# EAGLE schematic TamarinGroupMonitor1 v24 (EAGLE 9.7.0)
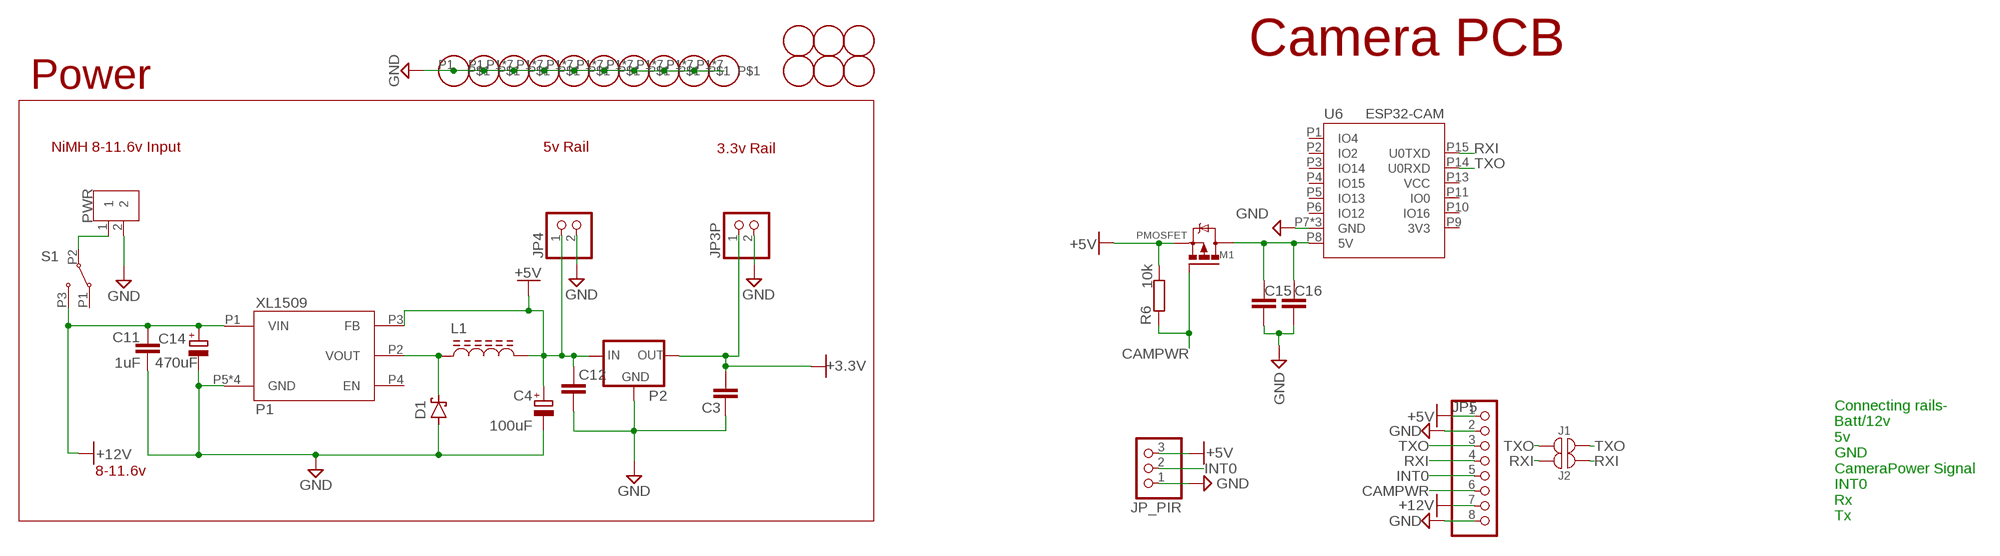
[diagram p0: schematic, sheet 1, part 1 of 2]
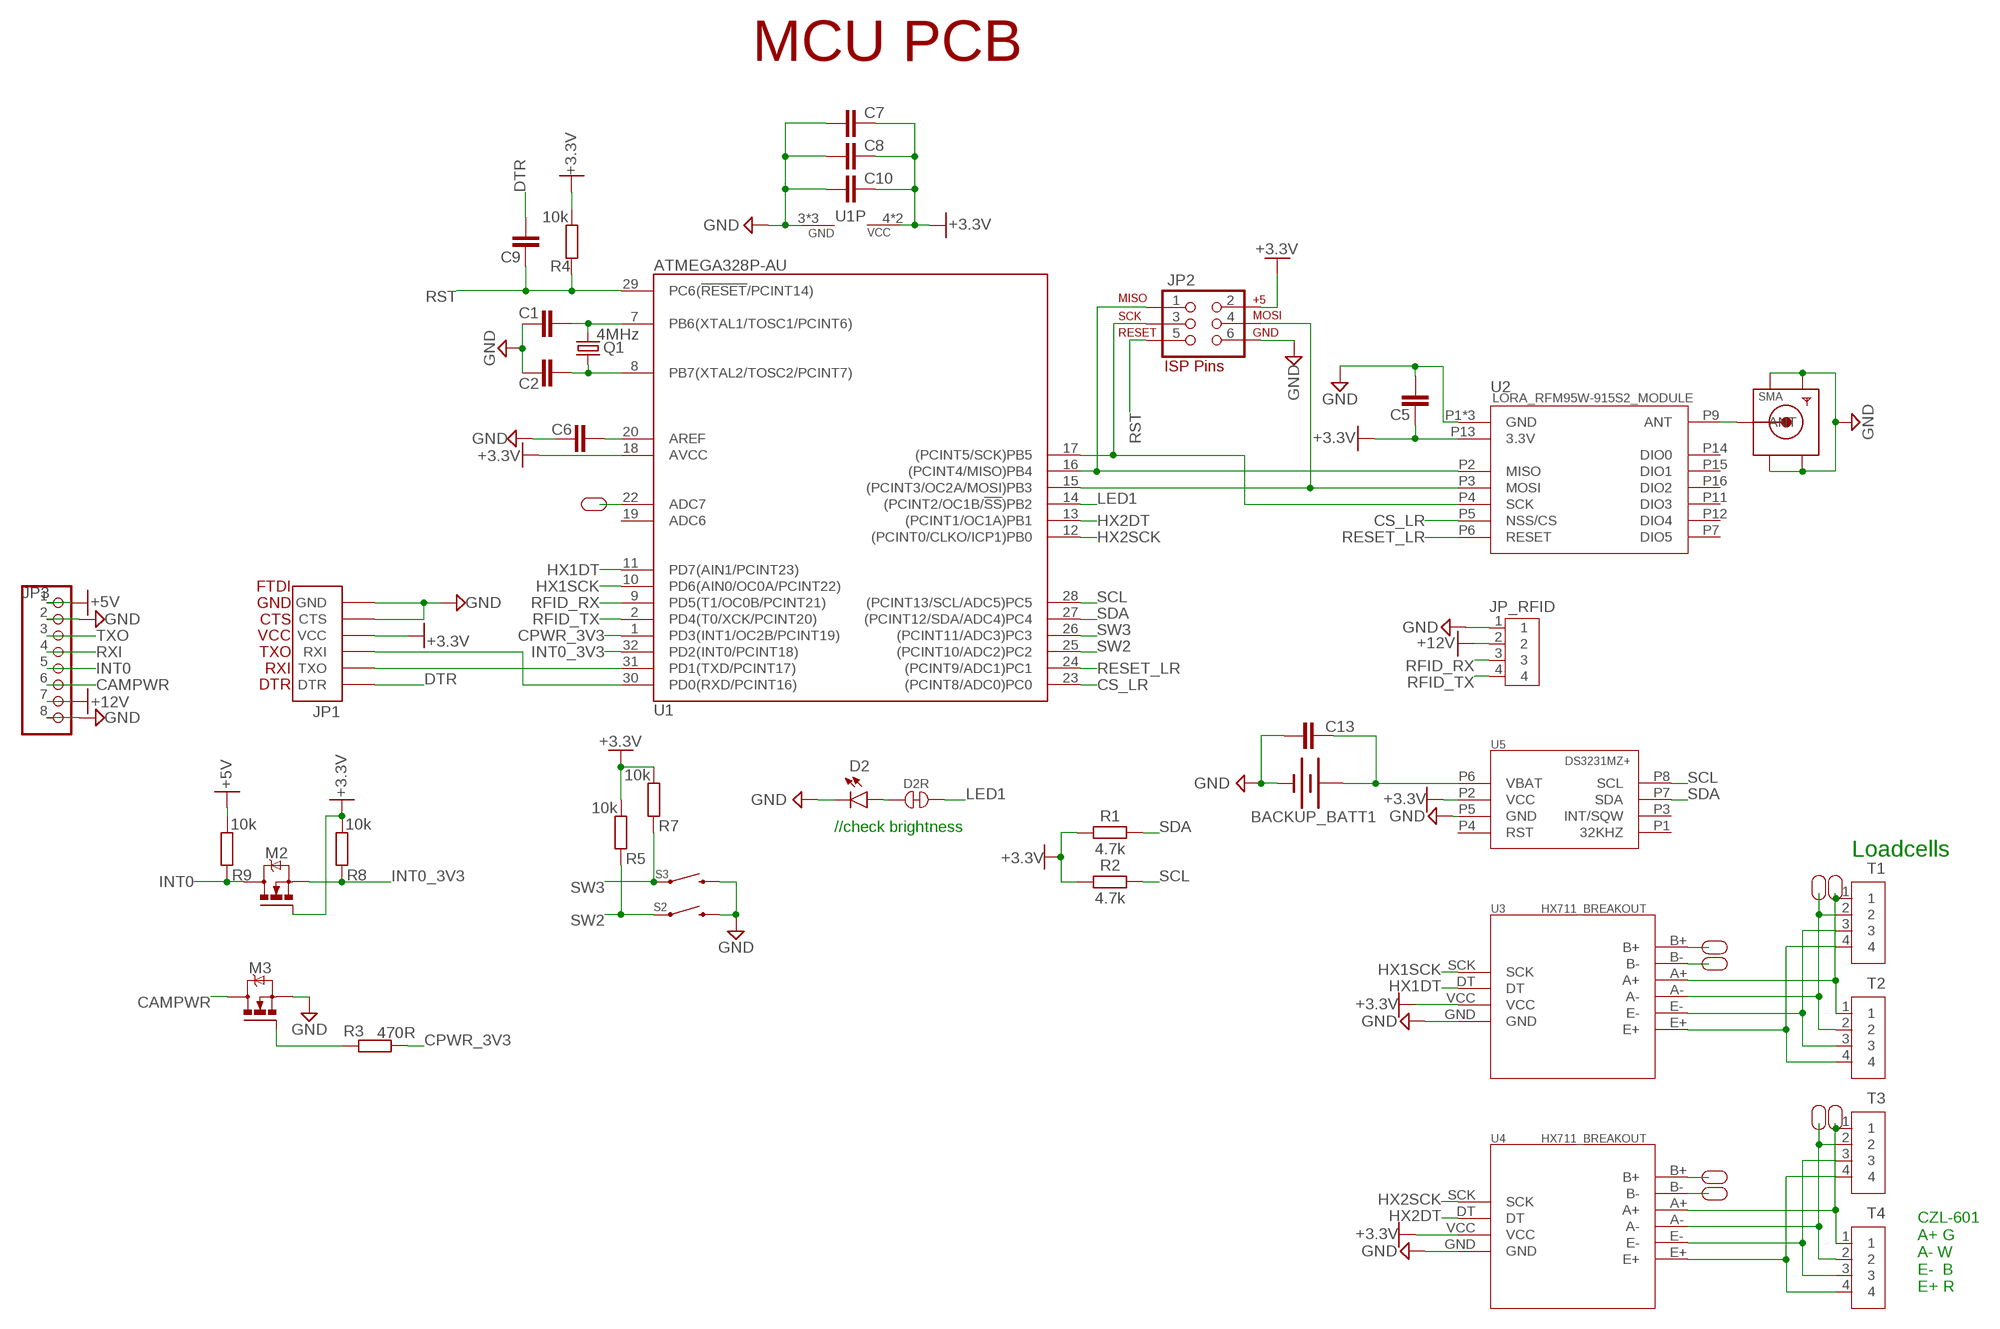
[diagram p1: schematic, sheet 1, part 2 of 2]

## Parts
ADC7  BREAKOUT_PADL  [BREAKOUT_PAD*1*1X2MM]
BACKUP_BATT1  BATTERY-20MM_PTH  [BATTCOM_20MM_PTH]
C1  33pF  C_CHIP-0805(2012-METRIC)  [CAPC2012X110]
C2  33pF  C_CHIP-0805(2012-METRIC)  [CAPC2012X110]
C3  10uF  C_CHIP-0805(2012-METRIC)  [CAPC2012X110]
C4  100uF  C-POL  [CAP_2P_5X11]
C5  0.1uF  C_CHIP-0805(2012-METRIC)  [CAPC2012X110]
C6  0.1uF  C_CHIP-0805(2012-METRIC)  [CAPC2012X110]
C7  0.1uF  C_CHIP-0805(2012-METRIC)  [CAPC2012X110]
C8  0.1uF  C_CHIP-0805(2012-METRIC)  [CAPC2012X110]
C9  0.1uF  C_CHIP-0805(2012-METRIC)  [CAPC2012X110]
C10  4.7uF  C_CHIP-0805(2012-METRIC)  [CAPC2012X110]
C11  1uF  C_CHIP-0805(2012-METRIC)  [CAPC2012X110]
C12  10uF  C_CHIP-0805(2012-METRIC)  [CAPC2012X110]
C13  1uF  C_CHIP-0805(2012-METRIC)  [CAPC2012X110]
C14  470uF  C-POLCAP_5P_5X11  [CAP_5P_10X12.5]
C15  1uF  C_CHIP-0805(2012-METRIC)  [CAPC2012X110]
C16  0.1uF  C_CHIP-0805(2012-METRIC)  [CAPC2012X110]
D1  SCHOTTKY_DO-219  [SODFL3718X115]
D2  LED_BLUE  LED_RADIAL_BLUE  [LEDRD254W60D565H860B_B]
D2R  RESISTOR_JUMPER  [RESISTOR_JUMPER_0805_2012]
F1  FIDUCIAL  [FIDUCIAL_1MM]
F2  FIDUCIAL  [FIDUCIAL_1MM]
F3  FIDUCIAL  [FIDUCIAL_1MM]
F4  FIDUCIAL  [FIDUCIAL_1MM]
F5  FIDUCIAL  [FIDUCIAL_1MM]
F6  FIDUCIAL  [FIDUCIAL_1MM]
H1  MOUNTING_HOLES  [MOUNTING_HOLE_3MM]
H1A+  BREAKOUT_PADL  [BREAKOUT_PAD*1*1X2MM]
H1A-  BREAKOUT_PADL  [BREAKOUT_PAD*1*1X2MM]
H1B+  BREAKOUT_PADL  [BREAKOUT_PAD*1*1X2MM]
H1B-  BREAKOUT_PADL  [BREAKOUT_PAD*1*1X2MM]
H2  MOUNTING_HOLES  [MOUNTING_HOLE_3MM]
H2A+  BREAKOUT_PADL  [BREAKOUT_PAD*1*1X2MM]
H2A-  BREAKOUT_PADL  [BREAKOUT_PAD*1*1X2MM]
H2B+  BREAKOUT_PADL  [BREAKOUT_PAD*1*1X2MM]
H2B-  BREAKOUT_PADL  [BREAKOUT_PAD*1*1X2MM]
H3  MOUNTING_HOLES  [MOUNTING_HOLE_3MM]
H4  MOUNTING_HOLES  [MOUNTING_HOLE_3MM]
H5  MOUNTING_HOLES  [MOUNTING_HOLE_3MM]
H6  MOUNTING_HOLES  [MOUNTING_HOLE_3MM]
H7  MOUNTING_HOLES  [MOUNTING_HOLE_3MM]
H8  MOUNTING_HOLES  [MOUNTING_HOLE_3MM]
H9  MOUNTING_HOLESPLAIN  [PLAIN_HOLE_3MM]
H10  MOUNTING_HOLESPLAIN  [PLAIN_HOLE_3MM]
J1  NO_JUMPER  [NO_JUMPER]
J2  NO_JUMPER  [NO_JUMPER]
JP1  FTDI_DEVICE  [FTDI_DEVICE_SIDE]
JP2  AVR_SPI_PRG_6PTH  [2X3]
JP3  PINHD-1X8  [1X08]
JP3P  PINHD-1X2  [1X02]
JP4  PINHD-1X2  [1X02]
JP5  PINHD-1X8  [1X08]
JP_PIR  PINHD-1X3  [1X03]
JP_RFID  3A/250V  B4B-XH-A  [B4B-XH-A]
L1  68uh  INDUCTOR_12MM_SHIELDED  [INDUCTOR_12X12MM]
M1  PMOSFET  PMOSFET_SOT23  [SOT23]
M2  NMOSFET  NMOSFETSOT23  [SOT23]
M3  NMOSFET  NMOSFETSOT23  [SOT23]
P1  XL1509  [XL1509_SOIC8]
P2  LDO-LM11173.3MP  [SOT223]
PWR  2828XX-2282837-2  [TERMBLK_508-2N]
Q1  4MHz  CRYSTALHC49UP  [HC49UP]
R1  4.7k  R_CHIP-0805(2012-METRIC)  [RESC2012X65]
R2  4.7k  R_CHIP-0805(2012-METRIC)  [RESC2012X65]
R3  470R  R_CHIP-0805(2012-METRIC)  [RESC2012X65]
R4  10k  R_CHIP-0805(2012-METRIC)  [RESC2012X65]
R5  10k  R_CHIP-0805(2012-METRIC)  [RESC2012X65]
R6  10k  R_CHIP-0805(2012-METRIC)  [RESC2012X65]
R7  10k  R_CHIP-0805(2012-METRIC)  [RESC2012X65]
R8  10k  R_CHIP-0805(2012-METRIC)  [RESC2012X65]
R9  10k  R_CHIP-0805(2012-METRIC)  [RESC2012X65]
S1  1P2T_SLIDE_SWITCHRIGHT  [1P2T_SLIDE_SWITCH_RIGHT]
S2  MOMENTARY-SWITCH-SPST-PTH-12MM  [TACTILE_SWITCH_PTH_12MM]
S3  MOMENTARY-SWITCH-SPST-PTH-12MM  [TACTILE_SWITCH_PTH_12MM]
SMA  SMACONNECTOR_EDGE  [SMA_EDGELAUNCH]
T1  2828XX-4282837-4  [TERMBLK_508-4N]
T2  2828XX-4282837-4  [TERMBLK_508-4N]
T3  2828XX-4282837-4  [TERMBLK_508-4N]
T4  2828XX-4282837-4  [TERMBLK_508-4N]
U1  ATMEGA328P-AU  [QFP32_7X7_0.80]
U2  LORA_RFM95W-915S2_MODULE  [LORA_RFM95W-915S2_16MODULE]
U3  HX711_BREAKOUT  [HX711_BREAKOUT]
U4  HX711_BREAKOUT  [HX711_BREAKOUT]
U5  DS3231MZ+  [DS3231MZ+_SOIC8]
U6  ESP32-CAM  [ESP32-CAM-FOOTPRINT]

## Nets
+3.3V [Power]: C3.2 C5.1 C7.1 C8.1 C10.1 JP1.P$4(VCC) JP2.2 JP3P.1 M2.1(G) P2.2(OUT) P2.4(OUT) R1.1 R2.1 R4.1 R5.1 R7.1 R8.1 U1.4(VCC) U1.6(VCC) U1.18(AVCC) U2.P13(3.3V) U3.VCC U4.VCC U5.P2(VCC)
+5V [Power]: C4.1(+) C12.1 JP3.1 JP4.1 JP5.1 JP_PIR.3 L1.P$2(A2) M1.2(S) P1.P3(FB) P2.3(IN) R6.1 R9.1
+12V [Power]: C11.1 C14.1(+) JP3.7 JP5.7 JP_RFID.2 P1.P1(VIN) S1.P3
ADC7: ADC7.P$1 U1.22(ADC7)
AREF: C6.2 U1.20(AREF)
BATT [Power]: PWR.1 S1.P2
CAMPWR: JP3.6 JP5.6 M1.1(G) M3.3(D) R6.2
CPWR: M3.1(G) R3.2
CPWR_3V3: R3.1 U1.1(PD3(INT1/OC2B/PCINT19))
CS_LR: U1.23((PCINT8/ADC0)PC0) U2.P5(NSS/CS)
DTR: C9.2 JP1.P$1(DTR)
ESP32_PWR [Power]: C15.1 C16.1 M1.3(D) U6.P8(5V)
GND [Power]: BACKUP_BATT1.2(-) C1.1 C2.1 C3.1 C4.2(-) C5.2 C6.1 C7.2 C8.2 C10.2 C11.2 C12.2 C13.2 C14.2(-) C15.2 C16.2 D1.2(A) D2.2(C) H1.P1 H1.P2 H1.P3 H1.P4 H1.P5 H1.P6 H1.P7 H2.P1 H2.P2 H2.P3 H2.P4 H2.P5 H2.P6 H2.P7 H3.P1 H3.P2 H3.P3 H3.P4 H3.P5 H3.P6 H3.P7 H4.P1 H4.P2 H4.P3 H4.P4 H4.P5 H4.P6 H4.P7 H5.P1 H5.P2 H5.P3 H5.P4 H5.P5 H5.P6 H5.P7 H6.P1 H6.P2 H6.P3 H6.P4 H6.P5 H6.P6 H6.P7 H7.P1 H7.P2 H7.P3 H7.P4 H7.P5 H7.P6 H7.P7 H8.P1 H8.P2 H8.P3 H8.P4 H8.P5 H8.P6 H8.P7 H9.P1 H10.P1 JP1.P$5(CTS) JP1.P$6(GND) JP2.6 JP3.2 JP3.8 JP3P.2 JP4.2 JP5.2 JP5.8 JP_PIR.1 JP_RFID.1 M3.2(S) P1.P5(GND) P1.P6(GND) P1.P7(GND) P1.P8(GND) P2.1(GND) PWR.2 S2.3 S2.4 S3.3 S3.4 SMA.GND@1(GND4) SMA.GND@2(GND3) SMA.GND@3(GND2) SMA.GND@4(GND1) U1.3(GND) U1.5(GND) U1.21(GND) U2.P1(GND) U2.P8(GND) U2.P10(GND) U3.GND U4.GND U5.P5(GND) U6.P7(GND) U6.P12(GND) U6.P16(GND)
HC1A+: H1A+.P$1 T1.1 T2.1 U3.A+
HC1A-: H1A-.P$1 T1.2 T2.2 U3.A-
HC1B+: H1B+.P$1 U3.B+
HC1B-: H1B-.P$1 U3.B-
HC1E+: T1.4 T2.4 U3.E+
HC1E-: T1.3 T2.3 U3.E-
HC2A+: H2A+.P$1 T3.1 T4.1 U4.A+
HC2A-: H2A-.P$1 T3.2 T4.2 U4.A-
HC2B+: H2B+.P$1 U4.B+
HC2B-: H2B-.P$1 U4.B-
HC2E+: T3.4 T4.4 U4.E+
HC2E-: T3.3 T4.3 U4.E-
HX1DT: U1.11(PD7(AIN1/PCINT23)) U3.DT
HX1SCK: U1.10(PD6(AIN0/OC0A/PCINT22)) U3.SCK
HX2DT: U1.13((PCINT1/OC1A)PB1) U4.DT
HX2SCK: U1.12((PCINT0/CLKO/ICP1)PB0) U4.SCK
INT0: JP3.5 JP5.5 JP_PIR.2 M2.3(D) R9.2
INT0_3V3: M2.2(S) R8.2 U1.32(PD2(INT0/PCINT18))
LED1: D2R.P2 U1.14((PCINT2/OC1B/!SS!)PB2)
LED1A: D2.1(A) D2R.P1
LR_ANT [RF]: SMA.P(ANT) U2.P9(ANT)
MISO: JP2.1 U1.16((PCINT4/MISO)PB4) U2.P2(MISO)
MOSI: JP2.4 U1.15((PCINT3/OC2A/MOSI)PB3) U2.P3(MOSI)
Q1: C2.2 Q1.1 U1.8(PB7(XTAL2/TOSC2/PCINT7))
Q2: C1.2 Q1.2 U1.7(PB6(XTAL1/TOSC1/PCINT6))
RESET_LR: U1.24((PCINT9/ADC1)PC1) U2.P6(RESET)
RFID_RX: JP_RFID.3 U1.9(PD5(T1/OC0B/PCINT21))
RFID_TX: JP_RFID.4 U1.2(PD4(T0/XCK/PCINT20))
RST: C9.1 JP2.5 R4.2 U1.29(PC6(!RESET!/PCINT14))
RTC_BATT [Power]: BACKUP_BATT1.1(+) C13.1 U5.P6(VBAT)
RXI: J2.P$1 J2.P$2 JP1.P$3(RXI) JP3.4 JP5.4 U1.30(PD0(RXD/PCINT16)) U6.P15(U0TXD)
SCK: JP2.3 U1.17((PCINT5/SCK)PB5) U2.P4(SCK)
SCL: R2.2 U1.28((PCINT13/SCL/ADC5)PC5) U5.P8(SCL)
SDA: R1.2 U1.27((PCINT12/SDA/ADC4)PC4) U5.P7(SDA)
SW2: R5.2 S2.1 S2.2 U1.25((PCINT10/ADC2)PC2)
SW3: R7.2 S3.1 S3.2 U1.26((PCINT11/ADC3)PC3)
TXO: J1.P$1 J1.P$2 JP1.P$2(TXO) JP3.3 JP5.3 U1.31(PD1(TXD/PCINT17)) U6.P14(U0RXD)
XLVO [Power]: D1.1(C) L1.P$1(A1) P1.P2(VOUT)
Unconnected: P1.P4(EN) S1.P1 U1.19(ADC6) U2.P7(DIO5) U2.P11(DIO3) U2.P12(DIO4) U2.P14(DIO0) U2.P15(DIO1) U2.P16(DIO2) U5.P1(32KHZ) U5.P3(INT/SQW) U5.P4(RST) U6.P1(IO4) U6.P2(IO2) U6.P3(IO14) U6.P4(IO15) U6.P5(IO13) U6.P6(IO12) U6.P9(3V3) U6.P10(IO16) U6.P11(IO0) U6.P13(VCC)

## Notes on the sheet
- MCU PCB
- Camera PCB
- Power
- NiMH 8-11.6v Input | 5v Rail | 3.3v Rail
- ISP Pins
- FTDI
  GND
  CTS
  VCC
  TXO
  RXI
  DTR
- 8-11.6v
- Connecting rails-
  Batt/12v
  5v
  GND
  CameraPower Signal
  INT0
  Rx
  Tx
- //check brightness
- Loadcells
- CZL-601
  A+ G
  A- W
  E-  B
  E+ R

## Library data of the parts
ADC7 H1A+ H1A- H1B+ H1B- H2A+ H2A- H2B+ H2B- = CDC Library:BREAKOUT_PAD
BACKUP_BATT1 = CDC Library:BATTERY: Battery - Single Cell A variety of battery chemistries, sizes, and footprints. Device List: 20MM_PTH - Coin Cell Battery Holder - 20mm (PTH) <https://www.sparkfun.com/products/783> 6.8MM_PTH - Coin Cell Battery Holder - 6.8MM(SMD) <https://www.digikey.com/product-detail/en/seiko-instruments/MS621FE-FL11E/728-1057-ND/1889208?WT.srch=1&gclid=CNOQ5a6LzdQCFZS2wAodXCkE0g> 12MM_SMD - Coin Cell Battery Holder - 12mm (SMD) <https://www.sparkfun.com/products/10592> 12MM_PTH - Coin Cell Battery Holder - 12mm (PTH) <https://www.sparkfun.com/products/7948> 20MM_SMD - 20mm Coin Cell Battery Holder (SMD) (2 legs) Used on the Big Time Watch Kit <https://www.sparkfun.com/products/11734> 20MM_SMD_4LEGS - Coin Cell Battery Holder - 20mm (SMD) <https://www.sparkfun.com/products/11892> 20MM_SMD_4LEGS_OVERPASTE - Coin Cell Battery Holder - 20mm (SMD) <https://www.sparkfun.com/products/11892> (Over-paste on the legs) 24.5MM_PTH - Coin Cell Battery Holder - 24.5mm (PTH) <https://www.sparkfun.com/products/8863> 9V - 9V Battery Holder - PC Mount Used on the SparkFun SparkPunk Sound Kit <https://www.sparkfun.com/products/11177> and SparkFun SparkPunk Sequencer Kit <https://www.sparkfun.com/products/12707> 18650 - Battery Holder - 18650 (PTH) <https://www.sparkfun.com/products/13113> AA - Battery Holder - 1xAA (PTH) <https://www.sparkfun.com/products/7949> AAA - Battery Holder - 1xAAA (PTH) <https://www.sparkfun.com/products/12718> AA_KIT - Battery Holder - 1xAA (PTH) <https://www.sparkfun.com/products/7949> Special kit package - pads only have exposed copper on one side of the board. AAA_KIT - Battery Holder - 1xAAA (PTH) <https://www.sparkfun.com/products/12718> Special kit package - pads only have exposed copper on one side of the board.; LINK: https://www.evelta.com/3v-litium-battery-holder/; PROD_ID: BATT-09031; SF_SKU: PRT-00783
C1 C2 = Capacitor:C: Capacitor - Generic; CATEGORY: Capacitor; LINK: https://www.evelta.com/33-pf-50v-0805-smd-multilayer-ceramic-capacitors-0805cg330j500nt-fenghua/
C3 C12 = Capacitor:C: Capacitor - Generic; CATEGORY: Capacitor; LINK: https://www.sunrom.com/p/10uf-106-smd-0805-pack-of-10
C4 = CDC Library:C-POL: Capacitor Polarised - Generic; LINK: https://www.evelta.com/100uf-25v-electrolytic-capacitor/
C5-C9 C16 = Capacitor:C: Capacitor - Generic; CATEGORY: Capacitor; LINK: https://www.sunrom.com/p/100nf-104-0805-2012-metric
C10 = Capacitor:C: Capacitor - Generic; CATEGORY: Capacitor; LINK: https://www.evelta.com/4-7-uf-16v-0805-smd-multi-layer-ceramic-capacitor-0805x475k160ct-walsin/
C11 C13 C15 = Capacitor:C: Capacitor - Generic; CATEGORY: Capacitor; LINK: https://www.sunrom.com/p/1uf-105-smd-0805-pack-of-10
C14 = CDC Library:C-POL: Capacitor Polarised - Generic; LINK: https://www.evelta.com/470uf-25v-electrolytic-capacitor/
D1 = CDC Library:SCHOTTKY_: Schottky Diode - Popular parts; LINK: https://www.sunrom.com/p/1n5819-b5819w-1n5819w-s4-sod123-1206-1a-40v-schottky-diode
D2 = Opto-Electronic:LED_RADIAL: LED - Generic; CATEGORY: Opto-Electronic; LINK: https://www.sunrom.com/p/blue-led-3mm; SUB-CATEGORY: LED
D2R = CDC Library:RESISTOR_JUMPER
F1-F6 = CDC Library:FIDUCIAL: For use by pick and place machines to calibrate the vision/machine, 1mm By microbuilder.eu
H1-H10 = CDC Library:MOUNTING_HOLES
J1 J2 = CDC Library:NO_JUMPER
JP1 = CDC Library:FTDI_DEVICE: Connector which mates to FTDI basic or FTDI cable.
JP2 = CDC Library:AVR_SPI_PRG_6: AVR ISP 6 Pin This is the reduced ISP connector for AVR programming. Common on Arduino. This footprint will take up less PCB space and can be used with a 10-pin to 6-pin adapter such as SKU: BOB-08508 **Special note about "TEST_POINT" package. The stop mask is on the top side, so if you want your programming test points to be on the bottom of your board, make sure to place this package on the bottom side of the board. This also ensure that the orientation to program from the bottom side will be correct.
JP3 JP5 = Connector:PINHD-1X8: PIN HEADER; CATEGORY: CONNECTOR; SUB-CATEGORY: PIN-HEADER
JP3P JP4 = Connector:PINHD-1X2: PIN HEADER; CATEGORY: CONNECTOR; SUB-CATEGORY: PIN-HEADER
JP_PIR = Connector:PINHD-1X3: PIN HEADER; CATEGORY: CONNECTOR; SUB-CATEGORY: PIN-HEADER
JP_RFID = Connector:B4B-XH-A: XH Connector Top Entry - 4POS Details see: Datasheet <http://www.jst-mfg.com/product/pdf/eng/eXH.pdf>; CATEGORY: CONNECTOR; DSECRIPTION: 2.5mm pitch/disconnctable crimp style connector; MANUFACTURER: JST (XH connector); MPN: B4B-XH-A; OPERATING_TEMPERATURE: -25 C to 85 C; PART_STATUS: ACTIVE; ROHS_COMPLIANT: COMPLAINT; SERIES: B4B-XH-A; SUB_CATEGORY: Through hole; TYPE: TOP ENTRY
L1 = CDC Library:INDUCTOR_12MM_SHIELDED; LINK: https://www.sunrom.com/p/68uh-680-12mm-inductor
M1 = Transistor:PMOSFET: P-Channel MOSFET - Generic; CATEGORY: Transistor; LINK1: https://www.sunrom.com/p/ao3401-a19t-sot-23-p-ch-mosfet; SUB-CATEGORY: MOSFET; TYPE: P-Channel
M2 M3 = Transistor:NMOSFET: N-Channel MOSFET - Generic; CATEGORY: Transistor; LINK: https://www.evelta.com/bss138lt1g-50v-220ma-n-channel-transistor-surface-mount-sot-23-3/; SUB-CATEGORY: MOSFET; TYPE: N-Channel
P1 = CDC Library:XL1509; LINK: https://www.sunrom.com/m/6161
P2 = CDC Library:LDO-LM1117: 800mA Low-Dropout Linear Regulator Source: http://ww1.microchip.com/downloads/en/DeviceDoc/39760d.pdf; LINK: https://www.sunrom.com/m/4004; MF: Texas Instruments; MPN: LM1117MP-3.3; OC_FARNELL: 9778195; OC_NEWARK: 28X3416
PWR = Connector:2828XX-2: 2 Position Wire to Board Terminal Block Horizontal with Board Datasheet <https://www.te.com.cn/commerce/DocumentDelivery/DDEController?Action=showdoc&DocId=Catalog+Section%7F1308389_EUROSTYLE_TERMINAL_BLOCKS%7F0607%7Fpdf%7FEnglish%7FENG_CS_1308389_EUROSTYLE_TERMINAL_BLOCKS_0607.pdf%7F2-282837-5>; CATEGORY: Connector; DESCRIPTION: 2 Position Wire to Board Terminal Block Horizontal with Board 5.08 mm Through Hole; MANUFACTURER: TE Connectivity; MPN: 282837-2; OPERATING_TEMPERATURE: -40°C to +105°C; PART_STATUS: ACTIVE; ROHS_COMPLIANCE: RoHS Compliant; SERIES: 282837; SUBCATEGORY: Terminal Block; TYPE: Side Wire Entry
Q1 = CDC Library:CRYSTAL: CRYSTAL; LINK: https://www.evelta.com/hc-49smd-4mhz-20pf-20ppm-2pad-smd-smt-quartz-crystal/; OC_FARNELL: unknown; OC_NEWARK: unknown
R1 R2 = Resistor:R: Resistor Fixed - Generic; CATEGORY: Resistor; LINK: https://www.sunrom.com/p/4k7-1-0805-pack-of-100; SUB-CATEGORY: Fixed
R3 = Resistor:R: Resistor Fixed - Generic; CATEGORY: Resistor; LINK: https://www.sunrom.com/p/470r-1-0805-pack-of-100; SUB-CATEGORY: Fixed
R4-R9 = Resistor:R: Resistor Fixed - Generic; CATEGORY: Resistor; LINK: https://www.sunrom.com/p/10k-1-0805-pack-of-100; SUB-CATEGORY: Fixed
S1 = CDC Library:1P2T_SLIDE_SWITCH; LINK: https://www.sunrom.com/p/slide-switch-1p2t-high-current-right-angle
S2 S3 = CDC Library:MOMENTARY-SWITCH-SPST: Momentary Switch (Pushbutton) - SPST Normally-open (NO) SPST momentary switches (buttons, pushbuttons). Variants PTH-12MM - 12mm square, through-hole Momentary Pushbutton Switch - 12mm Square <https://www.sparkfun.com/products/9190> (COM-09190) PTH-6.0MM, PTH-6.0MM-KIT - 6.0mm square, through-hole Mini Pushbutton Switch <https://www.sparkfun.com/products/97> (COM-00097) KIT package intended for soldering kit's - only one side of pads' copper is exposed. PTH-RIGHT-ANGLE-KIT - Right-angle, through-hole Right Angle Tactile Button <https://www.sparkfun.com/products/10791> - Used on SparkFun BigTime Watch Kit <https://www.sparkfun.com/products/11734> SMD-12MM - 12mm square, surface-mount Tactile Button - SMD (12mm) <https://www.sparkfun.com/products/12993> (COM-12993) Used on SparkFun PicoBoard <https://www.sparkfun.com/products/11888> SMD-4.5MM - 4.5mm Square Trackball Switch Used on SparkFun Blackberry Trackballer Breakout <https://www.sparkfun.com/products/13169> SMD-4.6MMX2.8MM - 4.60mm x 2.80mm, surface mount Used on SparkFun SAMD21 Mini Breakout <https://www.sparkfun.com/products/13664> SMD-5.2MM, SMD-5.2-REDUNDANT - 5.2mm square, surface-mount Mini Pushbutton Switch - SMD <https://www.sparkfun.com/products/8720> (COM-08720) Used on Arduino Pro Mini <https://www.sparkfun.com/products/11114> REDUNDANT package connects both switch circuits together SMD-6.0X3.5MM - 6.0 x 3.5mm, surface mount Momentary Reset Switch SMD <https://www.sparkfun.com/products/8229> (COM-08229) SMD-6.2MM-TALL - 6.2mm square, surface mount Tactile Button - SMD (6mm) <https://www.sparkfun.com/products/12992> Used on SparkFun Digital Sandbox <https://www.sparkfun.com/products/12651> SMD-RIGHT-ANGLE - Right-angle, surface mount Used on SparkFun Block for Intel® Edison - Arduino <https://www.sparkfun.com/products/13036>; LINK: https://www.sunrom.com/p/tactile-switch-square-head-omron-b3f-4055-12x12x73mm; PROD_ID: SWCH-09185; SF_SKU: COM-09190
SMA = CDC Library:SMACONNECTOR: SMA Connector 90° DIP SMA Connector, 50 Ohm (4UConnector: 07259)
T1-T4 = Connector:2828XX-4: 4 Position Wire to Board Terminal Block Horizontal with Board Datasheet <https://www.te.com.cn/commerce/DocumentDelivery/DDEController?Action=showdoc&DocId=Catalog+Section%7F1308389_EUROSTYLE_TERMINAL_BLOCKS%7F0607%7Fpdf%7FEnglish%7FENG_CS_1308389_EUROSTYLE_TERMINAL_BLOCKS_0607.pdf%7F2-282837-5>; CATEGORY: Connector; DESCRIPTION: TERM BLK 4P SIDE ENT 5.08mm PCB; MANUFACTURER: TE Connectivity; MPN: 282837-4; OPERATING_TEMPERATURE: 40°C to +105°C; PART_STATUS: Active; ROHS_COMPLIANCE: RoHS Compliant; SERIES: 283737; SUBCATEGORY: Terminal Block; TYPE: Side Wire Entry
U1 = CDC Library:ATMEGA*8: 8-bit AVR Microcontroller 4/8/16/32 kbytes flash 512/1k/1k/2k bytes SRAM 256/512/512/1k bytes EEPROM USART, 6/8-channel 10 bit ADC Pin compatible with Atmega8(L,A) Note: ADC6 and ADC7 are not available in 28-lead packages; LINK: https://www.evelta.com/atmega328p-au-ic-mcu-8bit-32kb-flash-32tqfp/
U2 = CDC Library:LORA_RFM95W-915S2_MODULE; LINK: https://www.digikey.in/product-detail/en/rf-solutions/RFM95W-915S2/RFM95W-915S2-ND/6564923
U3 U4 = CDC Library:HX711_BREAKOUT
U5 = CDC Library:DS3231MZ+; LINK: https://www.evelta.com/ds3231mz-maxim-integrated-alarm-rtc-i2c-2-3-v-to-5-5-v/
U6 = CDC Library:ESP32-CAM

## Net classes
1 Power: width 0.5 mm
2 RF: width 0.35 mm, drill 0.4 mm, clearance 0.203 mm